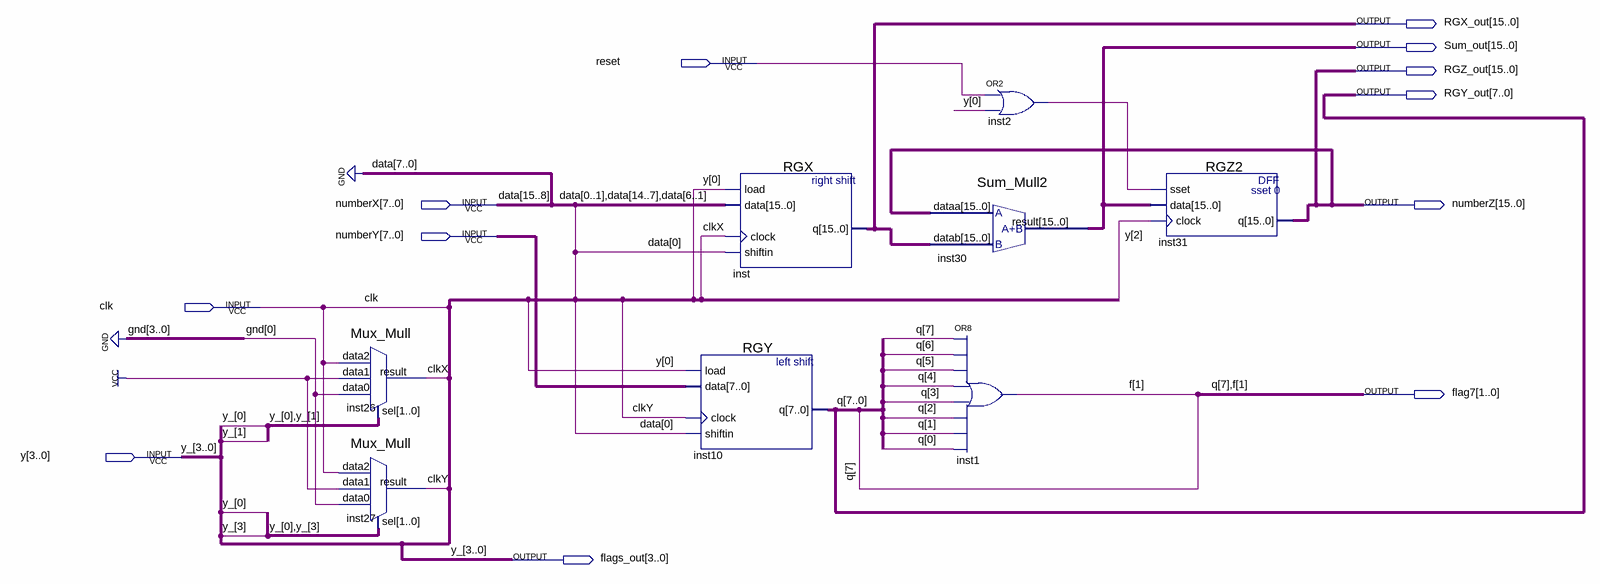
[diagram p0: schematic sheet]
// Quartus schematic Mull.bdf as structural Verilog: 8 symbols, 12 pins
module Mull (
  input  reset,
  input  [7:0] numberX,
  input  [7:0] numberY,
  input  clk,
  input  [3:0] y,
  output [15:0] RGX_out,
  output [15:0] Sum_out,
  output [15:0] RGZ_out,
  output [7:0] RGY_out,
  output [15:0] numberZ,
  output [1:0] flag7,
  output [3:0] flags_out
);

  wire clkX, clkY, inst2_out;

  Mux_Mull inst26 (.data2(clk), .data1(1'b1), .data0(1'b0), .sel({y[0], y[1]}), .result(clkX));
  Mux_Mull inst27 (.data2(clk), .data1(1'b1), .data0(1'b0), .sel({y[0], y[3]}), .result(clkY));
  RGY inst10 (.load(y[0]), .data(numberY), .clock(clkY), .shiftin(1'b0), .q({flag7[1], RGY_out[6:0]}));
  RGX inst (.load(y[0]), .data({2'b00, numberX[6:0], {7{1'b0}}}), .clock(clkX), .shiftin(1'b0), .q(RGX_out));
  Sum_Mull2 inst30 (.dataa(numberZ), .datab(RGX_out), .result(Sum_out));
  or inst2 (inst2_out, reset, y[0]);
  or inst1 (flag7[0], flag7[1], RGY_out[6], RGY_out[5], RGY_out[4], RGY_out[3], RGY_out[2], RGY_out[1], RGY_out[0]);
  RGZ2 inst31 (.sset(inst2_out), .data(Sum_out), .clock(y[2]), .q(numberZ));

  assign flags_out = y;
  assign RGY_out[7] = flag7[1];
  assign RGZ_out = numberZ;

  // Other names for the same wires on the sheet: data[15:8] = numberX; f[1] = flag7[0];
  //   q[7:0] = {flag7[1], RGY_out[6:0]}; y_[3:0] = y
endmodule
